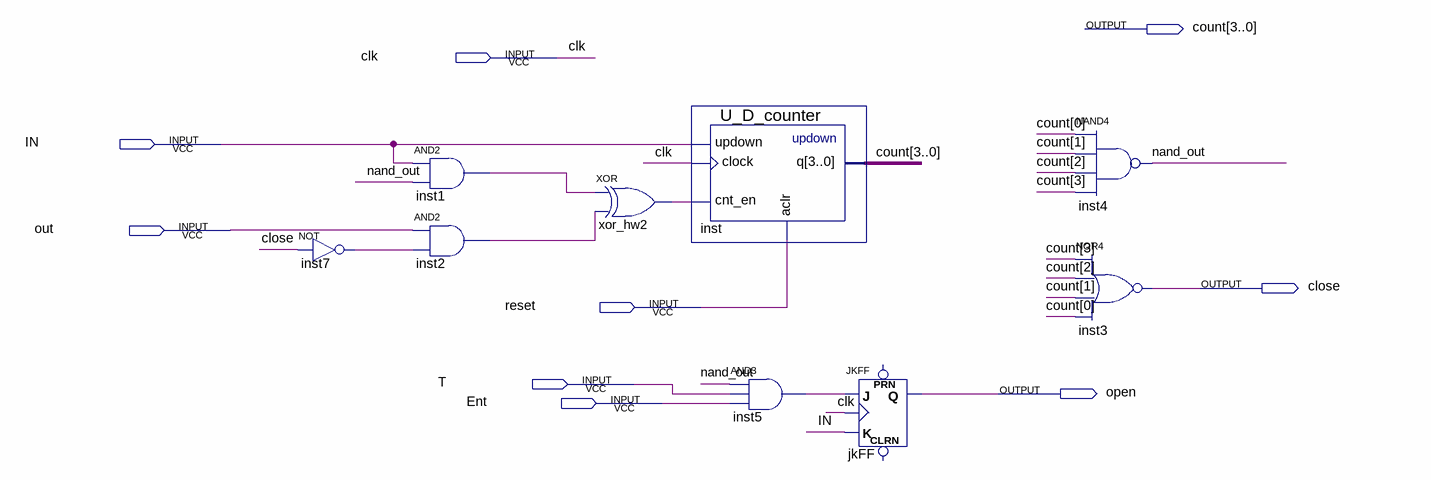
[diagram p0: schematic sheet]
// Quartus schematic HW2.bdf as structural Verilog: 9 symbols, 9 pins
module HW2 (
  input  clk,
  input  IN,
  input  out,
  input  reset,
  input  T,
  input  Ent,
  output [3:0] count,
  output close,
  output open
);

  wire inst1_out, inst2_out, inst5_out, inst7_out, nand_out, xor_hw2_out;

  not inst7 (inst7_out, close);
  and inst1 (inst1_out, IN, nand_out);
  and inst2 (inst2_out, out, inst7_out);
  xor xor_hw2 (xor_hw2_out, inst1_out, inst2_out);
  U_D_counter inst (.updown(IN), .clock(clk), .cnt_en(xor_hw2_out), .aclr(reset), .q(count));
  and inst5 (inst5_out, nand_out, T, Ent);
  JKFF jkFF (.K(IN), .J(inst5_out), .CLK(clk), .Q(open));  // open: PRN, CLRN
  nand inst4 (nand_out, count[0], count[1], count[2], count[3]);
  nor inst3 (close, count[3], count[2], count[1], count[0]);
endmodule
